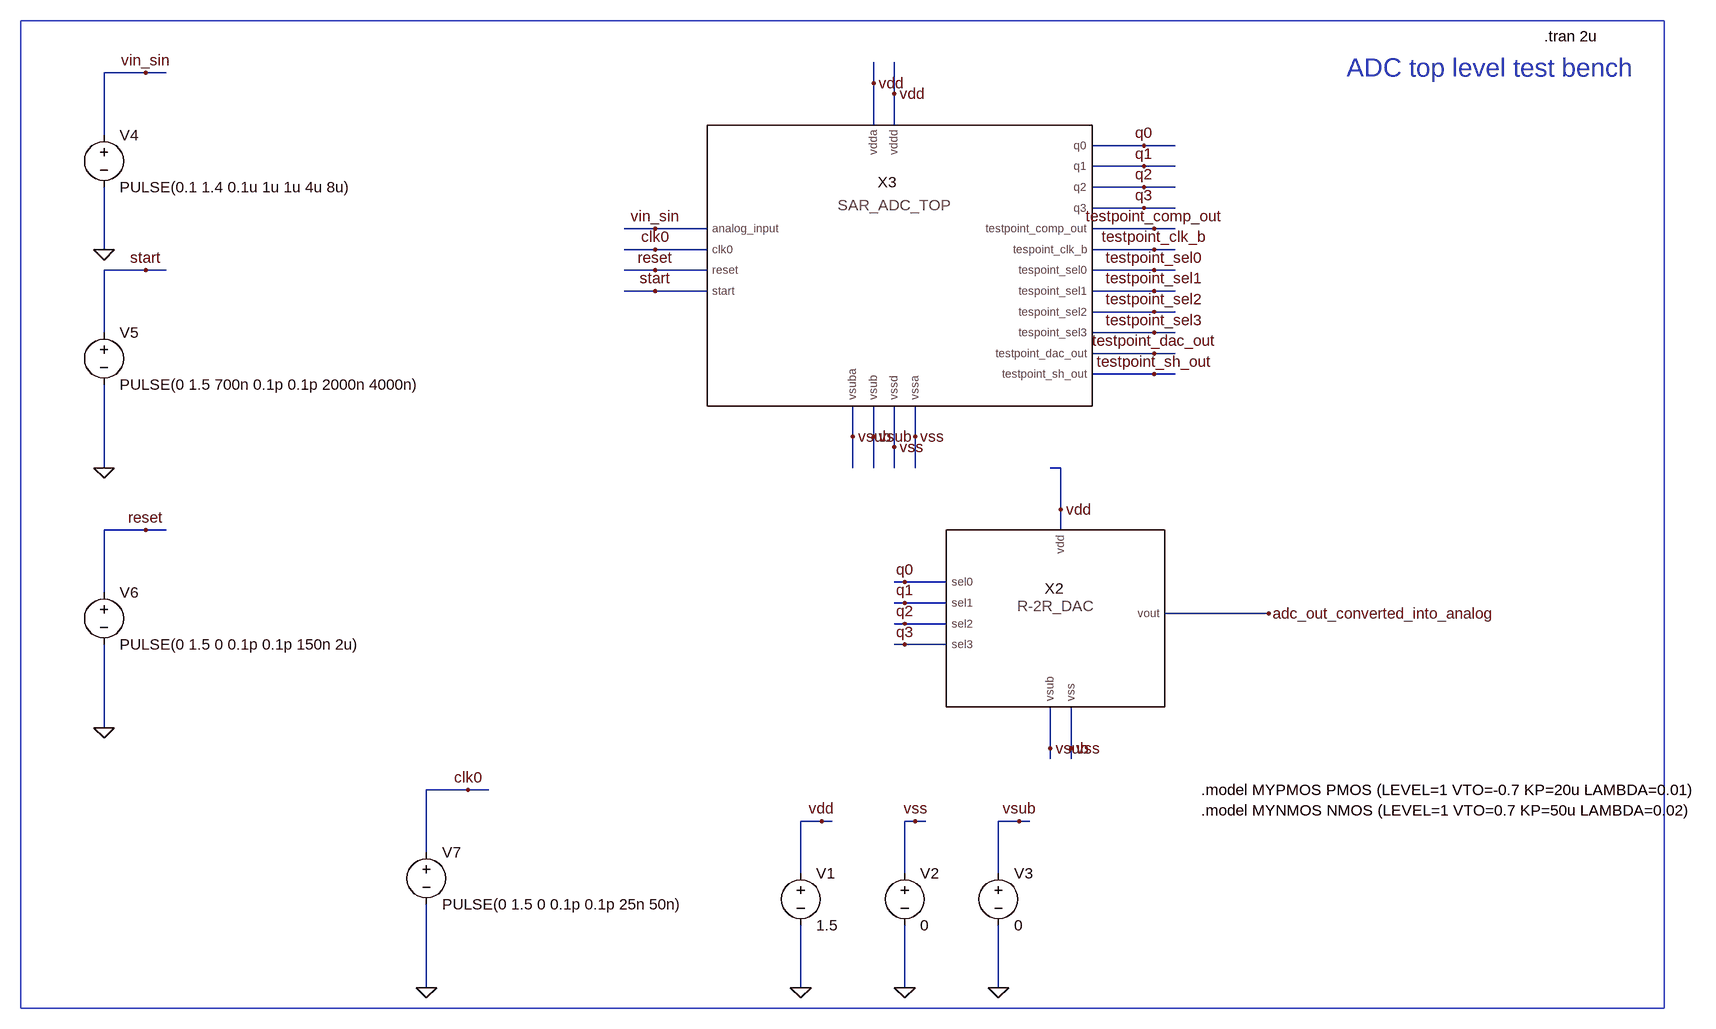
[diagram p0: schematic dsproj_adctop_tb.asc]
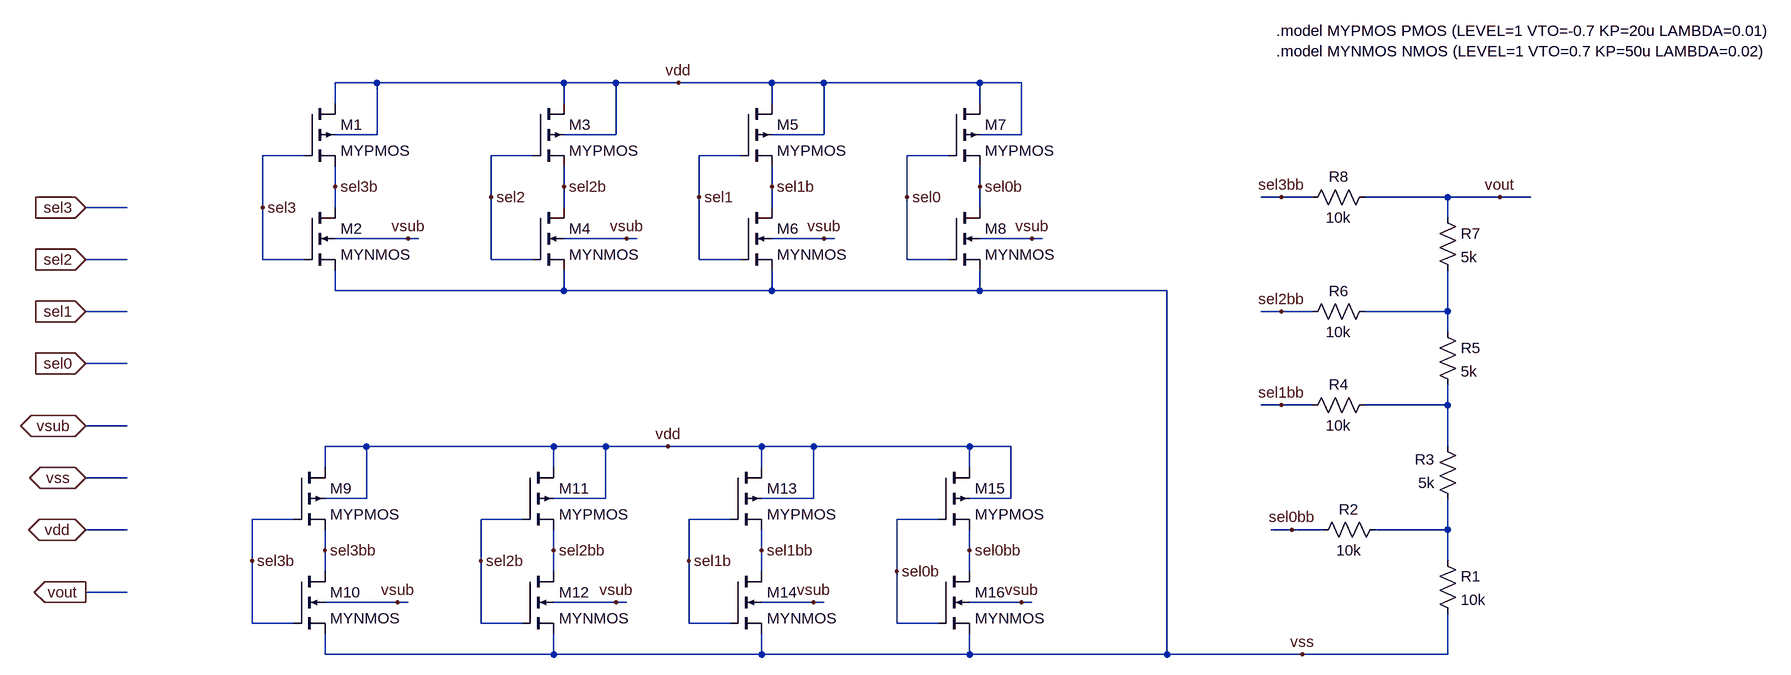
[diagram p1: sub-circuit dsproj_r2rdac.asc]
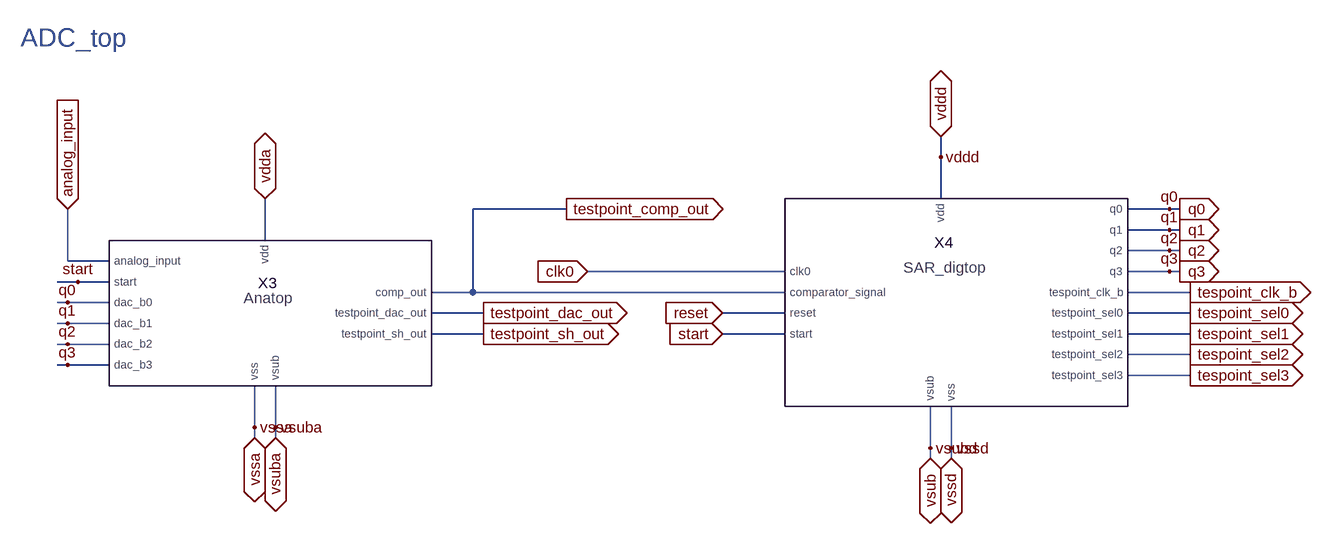
[diagram p2: sub-circuit dsproj_adctop.asc]
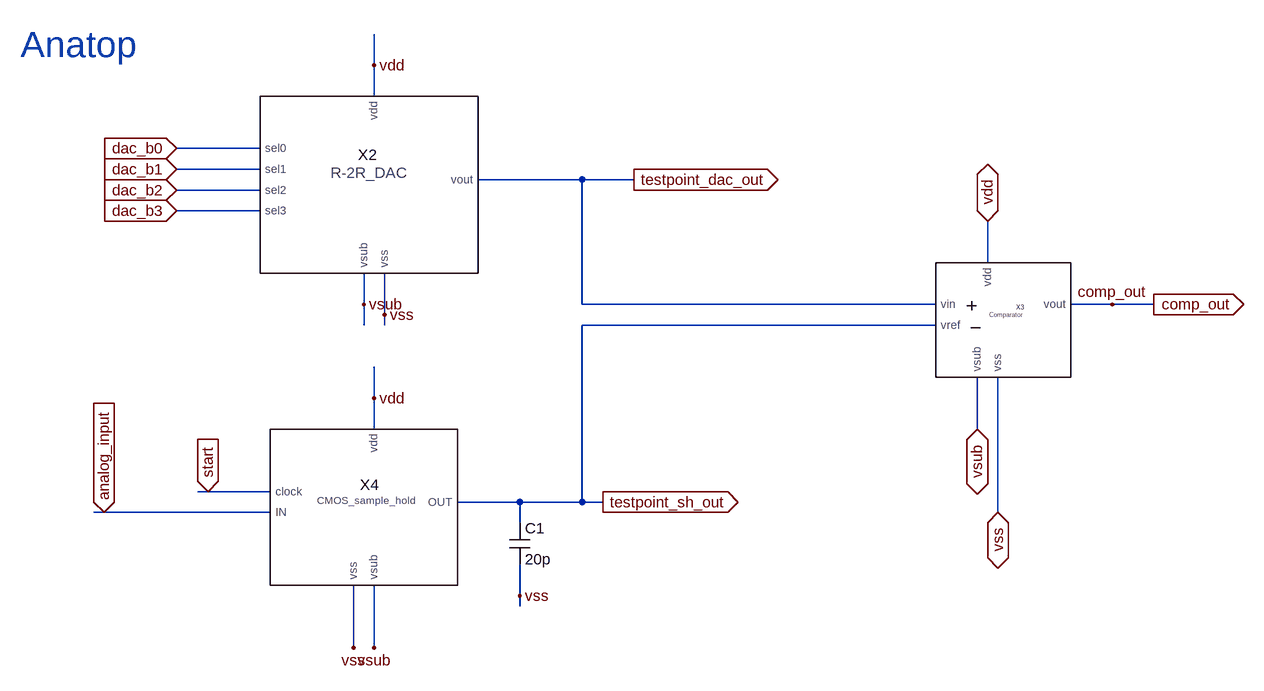
[diagram p3: sub-circuit dsproj_anatop.asc]
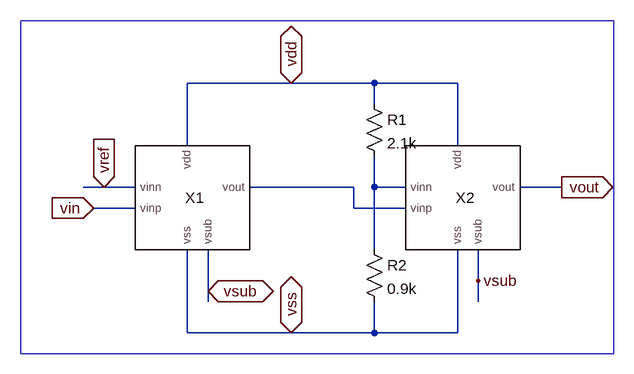
[diagram p4: sub-circuit dsproj_twostagecomparator.asc]
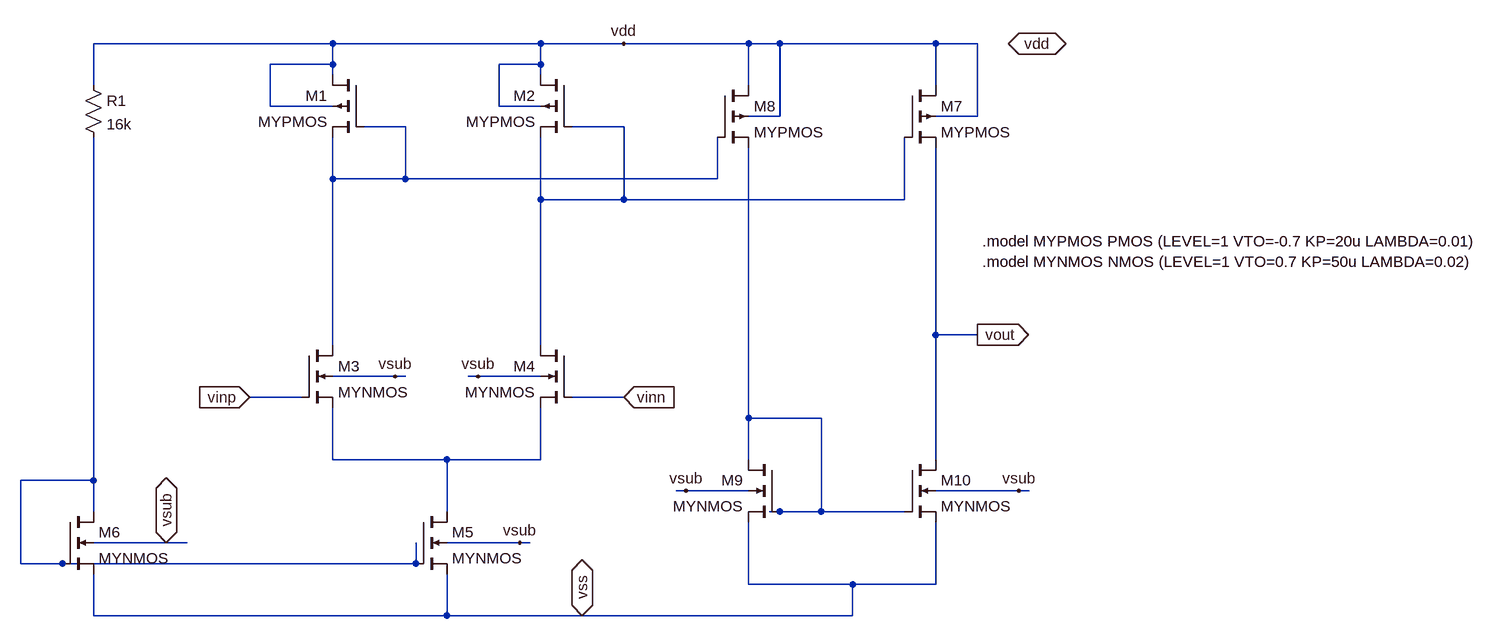
[diagram p5: sub-circuit dsproj_nmos_comparator.asc]
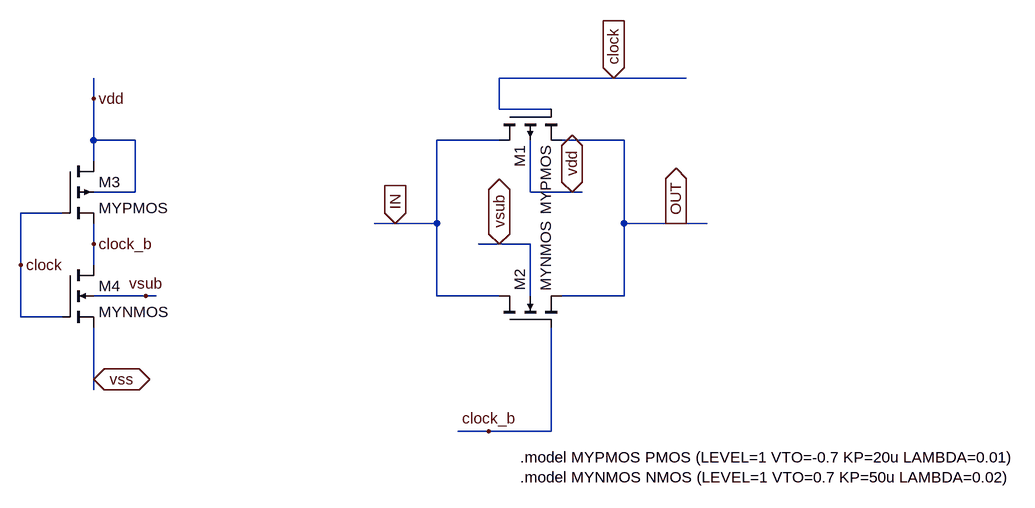
[diagram p6: sub-circuit dsproj_cmossampleandhold.asc]
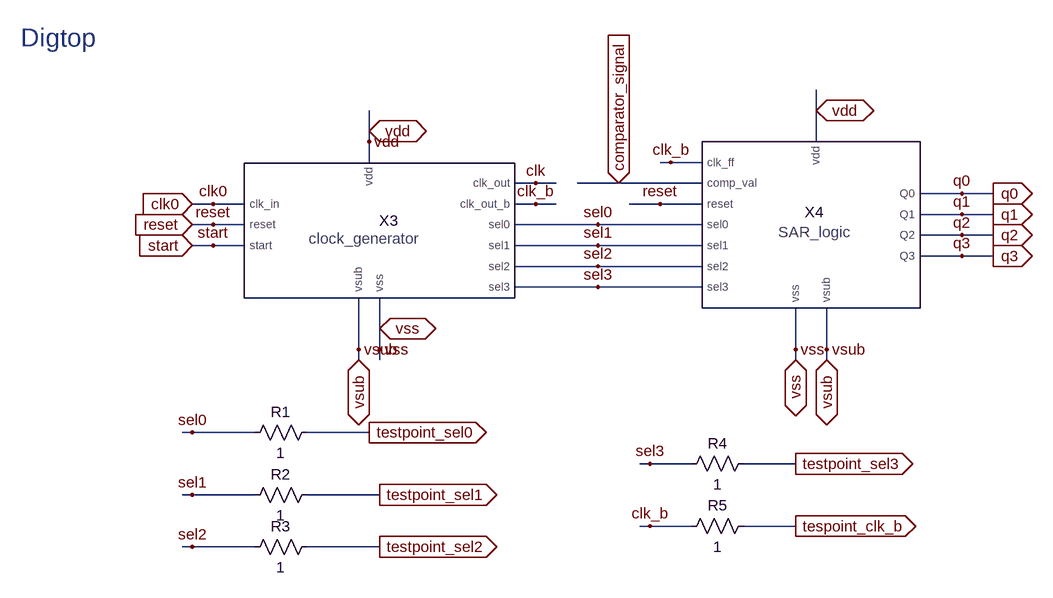
[diagram p7: sub-circuit dsproj_digtop.asc]
dsproj_adctop_tb.asc, the LTspice schematic file:
Version 4.1
SHEET 1 3284 1940
WIRE -1664 112 -1728 112
WIRE -1632 112 -1664 112
WIRE -544 128 -544 96
WIRE -512 144 -512 96
WIRE -544 192 -544 128
WIRE -512 192 -512 144
WIRE -1728 208 -1728 112
WIRE -128 224 -208 224
WIRE -80 224 -128 224
WIRE -128 256 -208 256
WIRE -80 256 -128 256
WIRE -128 288 -208 288
WIRE -80 288 -128 288
WIRE -128 320 -208 320
WIRE -80 320 -128 320
WIRE -880 352 -928 352
WIRE -800 352 -880 352
WIRE -112 352 -208 352
WIRE -80 352 -112 352
WIRE -1728 384 -1728 288
WIRE -880 384 -928 384
WIRE -800 384 -880 384
WIRE -112 384 -208 384
WIRE -80 384 -112 384
WIRE -1664 416 -1728 416
WIRE -1632 416 -1664 416
WIRE -880 416 -928 416
WIRE -800 416 -880 416
WIRE -112 416 -208 416
WIRE -80 416 -112 416
WIRE -880 448 -928 448
WIRE -800 448 -880 448
WIRE -112 448 -208 448
WIRE -80 448 -112 448
WIRE -112 480 -208 480
WIRE -80 480 -112 480
WIRE -1728 512 -1728 416
WIRE -112 512 -208 512
WIRE -80 512 -112 512
WIRE -112 544 -208 544
WIRE -80 544 -112 544
WIRE -112 576 -208 576
WIRE -80 576 -112 576
WIRE -576 672 -576 624
WIRE -544 672 -544 624
WIRE -480 672 -480 624
WIRE -512 688 -512 624
WIRE -1728 720 -1728 592
WIRE -576 720 -576 672
WIRE -544 720 -544 672
WIRE -512 720 -512 688
WIRE -480 720 -480 672
WIRE -256 720 -272 720
WIRE -256 784 -256 720
WIRE -1664 816 -1728 816
WIRE -1632 816 -1664 816
WIRE -256 816 -256 784
WIRE -496 896 -512 896
WIRE -432 896 -496 896
WIRE -1728 912 -1728 816
WIRE -496 928 -512 928
WIRE -432 928 -496 928
WIRE 64 944 -96 944
WIRE -496 960 -512 960
WIRE -432 960 -496 960
WIRE -496 992 -512 992
WIRE -432 992 -496 992
WIRE -1728 1120 -1728 992
WIRE -272 1152 -272 1088
WIRE -240 1152 -240 1088
WIRE -272 1168 -272 1152
WIRE -240 1168 -240 1152
WIRE -1168 1216 -1232 1216
WIRE -1136 1216 -1168 1216
WIRE -624 1264 -656 1264
WIRE -608 1264 -624 1264
WIRE -480 1264 -496 1264
WIRE -464 1264 -480 1264
WIRE -320 1264 -352 1264
WIRE -304 1264 -320 1264
WIRE -1232 1312 -1232 1216
WIRE -656 1344 -656 1264
WIRE -496 1344 -496 1264
WIRE -352 1344 -352 1264
WIRE -1232 1520 -1232 1392
WIRE -656 1520 -656 1424
WIRE -496 1520 -496 1424
WIRE -352 1520 -352 1424
FLAG -656 1520 0
FLAG -496 1520 0
FLAG -352 1520 0
FLAG -624 1264 vdd
FLAG -480 1264 vss
FLAG -320 1264 vsub
FLAG -544 128 vdd
FLAG -512 144 vdd
FLAG -576 672 vsub
FLAG -544 672 vsub
FLAG -512 688 vss
FLAG -480 672 vss
FLAG -128 224 q0
FLAG -128 256 q1
FLAG -128 288 q2
FLAG -128 320 q3
FLAG -112 384 testpoint_clk_b
FLAG -112 416 testpoint_sel0
FLAG -112 448 testpoint_sel1
FLAG -112 480 testpoint_sel2
FLAG -112 512 testpoint_sel3
FLAG -112 544 testpoint_dac_out
FLAG -112 576 testpoint_sh_out
FLAG -112 352 testpoint_comp_out
FLAG -880 352 vin_sin
FLAG -880 384 clk0
FLAG -880 416 reset
FLAG -880 448 start
FLAG -1728 384 0
FLAG -1728 720 0
FLAG -1664 416 start
FLAG -1728 1120 0
FLAG -1664 816 reset
FLAG -1232 1520 0
FLAG -1168 1216 clk0
FLAG -496 896 q0
FLAG -496 928 q1
FLAG -496 960 q2
FLAG -496 992 q3
FLAG -256 784 vdd
FLAG -272 1152 vsub
FLAG -240 1152 vss
FLAG 64 944 adc_out_converted_into_analog
FLAG -1664 112 vin_sin
SYMBOL voltage -656 1328 R0
WINDOW 123 0 0 Left 0
WINDOW 39 0 0 Left 0
SYMATTR InstName V1
SYMATTR Value 1.5
SYMBOL voltage -496 1328 R0
WINDOW 123 0 0 Left 0
WINDOW 39 0 0 Left 0
SYMATTR InstName V2
SYMATTR Value 0
SYMBOL voltage -352 1328 R0
WINDOW 123 0 0 Left 0
WINDOW 39 0 0 Left 0
SYMATTR InstName V3
SYMATTR Value 0
SYMBOL voltage -1728 496 R0
WINDOW 123 0 0 Left 0
WINDOW 39 0 0 Left 0
SYMATTR InstName V5
SYMATTR Value PULSE(0 1.5 700n 0.1p 0.1p 2000n 4000n)
SYMBOL voltage -1728 896 R0
WINDOW 123 0 0 Left 0
WINDOW 39 0 0 Left 0
SYMATTR InstName V6
SYMATTR Value PULSE(0 1.5 0 0.1p 0.1p 150n 2u)
SYMBOL voltage -1232 1296 R0
WINDOW 123 0 0 Left 0
WINDOW 39 24 124 Left 2
SYMATTR InstName V7
SYMATTR Value PULSE(0 1.5 0 0.1p 0.1p 25n 50n)
SYMBOL dsproj_r2rdac -336 1024 R0
SYMATTR InstName X2
SYMBOL voltage -1728 192 R0
WINDOW 123 0 0 Left 0
WINDOW 39 0 0 Left 0
SYMATTR InstName V4
SYMATTR Value PULSE(0.1 1.4 0.1u 1u 1u 4u 8u)
SYMBOL dsproj_adctop -560 416 R0
SYMATTR InstName X3
TEXT 488 56 Left 2 !.tran 2u
TEXT 184 104 Left 4 ;ADC top level test bench
TEXT -40 1216 Left 2 !.model MYPMOS PMOS (LEVEL=1 VTO=-0.7 KP=20u LAMBDA=0.01)\n.model MYNMOS NMOS (LEVEL=1 VTO=0.7 KP=50u LAMBDA=0.02)
RECTANGLE Normal 672 1552 -1856 32

The netlist it stands for:
* dsproj_adctop_tb.asc
V1 vdd 0 1.5
V2 vss 0 0
V3 vsub 0 0
V5 start 0 PULSE(0 1.5 700n 0.1p 0.1p 2000n 4000n)
V6 reset 0 PULSE(0 1.5 0 0.1p 0.1p 150n 2u)
V7 clk0 0 PULSE(0 1.5 0 0.1p 0.1p 25n 50n)
X§X2 q0 q1 q2 q3 vdd adc_out_converted_into_analog vss vsub dsproj_r2rdac
V4 vin_sin 0 PULSE(0.1 1.4 0.1u 1u 1u 4u 8u)
X§X3 vin_sin clk0 reset start testpoint_clk_b testpoint_sel0 testpoint_sel1 testpoint_sel2 testpoint_sel3 testpoint_dac_out testpoint_sh_out vdd vdd vss vss vsub vsub q0 q1 q2 q3 testpoint_comp_out dsproj_adctop

* block symbol definitions
.subckt dsproj_r2rdac sel0 sel1 sel2 sel3 vdd vout vss vsub
M1 vdd sel3 sel3b vdd MYPMOS l=180e-9 w=2.4e-6
M2 sel3b sel3 vss vsub MYNMOS l=180e-9 w=1.2e-6
M3 vdd sel2 sel2b vdd MYPMOS l=180e-9 w=2.4e-6 m=1
M4 sel2b sel2 vss vsub MYNMOS l=180e-9 w=1.2e-6 m=1
M5 vdd sel1 sel1b vdd MYPMOS l=180e-9 w=2.4e-6 m=1
M6 sel1b sel1 vss vsub MYNMOS l=180e-9 w=1.2e-6 m=1
M7 vdd sel0 sel0b vdd MYPMOS l=180e-9 w=2.4e-6 m=1
M8 sel0b sel0 vss vsub MYNMOS l=180e-9 w=1.2e-6 m=1
M9 vdd sel3b sel3bb vdd MYPMOS l=180e-9 w=2.4e-6 m=1
M10 sel3bb sel3b vss vsub MYNMOS l=180e-9 w=1.2e-6 m=1
M11 vdd sel2b sel2bb vdd MYPMOS l=180e-9 w=2.4e-6 m=1
M12 sel2bb sel2b vss vsub MYNMOS l=180e-9 w=1.2e-6 m=1
M13 vdd sel1b sel1bb vdd MYPMOS l=180e-9 w=2.4e-6 m=1
M14 sel1bb sel1b vss vsub MYNMOS l=180e-9 w=1.2e-6 m=1
M15 vdd sel0b sel0bb vdd MYPMOS l=180e-9 w=2.4e-6 m=1
M16 sel0bb sel0b vss vsub MYNMOS l=180e-9 w=1.2e-6 m=1
R1 N003 vss 10k
R2 N003 sel0bb 10k
R3 N003 N002 5k
R4 sel1bb N002 10k
R5 N001 N002 5k
R6 N001 sel2bb 10k
R7 vout N001 5k
R8 vout sel3bb 10k
.model MYPMOS PMOS (LEVEL=1 VTO=-0.7 KP=20u LAMBDA=0.01)
.model MYNMOS NMOS (LEVEL=1 VTO=0.7 KP=50u LAMBDA=0.02)
.ends dsproj_r2rdac

.subckt dsproj_adctop analog_input clk0 reset start tespoint_clk_b tespoint_sel0 tespoint_sel1 tespoint_sel2 tespoint_sel3 testpoint_dac_out testpoint_sh_out vdda vddd vssa vssd vsub vsuba q0 q1 q2 q3 testpoint_comp_out
X§X3 analog_input q0 q1 q2 q3 testpoint_comp_out testpoint_dac_out testpoint_sh_out vdda vssa vsuba start dsproj_anatop
X§X4 clk0 testpoint_comp_out reset start q0 q1 q2 q3 tespoint_clk_b tespoint_sel0 tespoint_sel1 tespoint_sel2 tespoint_sel3 vddd vssd vsub dsproj_digtop
* ADC_top
.ends dsproj_adctop

.subckt dsproj_anatop analog_input dac_b0 dac_b1 dac_b2 dac_b3 comp_out testpoint_dac_out testpoint_sh_out vdd vss vsub start
X§X2 dac_b0 dac_b1 dac_b2 dac_b3 vdd testpoint_dac_out vss vsub dsproj_r2rdac
X§X3 testpoint_dac_out testpoint_sh_out vdd comp_out vss vsub dsproj_twostagecomparator
C1 testpoint_sh_out vss 20p
X§X4 analog_input start testpoint_sh_out vdd vsub vss dsproj_cmossampleandhold
* Anatop
.ends dsproj_anatop

.subckt dsproj_twostagecomparator vin vref vdd vout vss vsub
XX1 vref vin vdd N001 vss vsub dsproj_nmos_comparator
XX2 N002 N001 vdd vout vss vsub dsproj_nmos_comparator
R1 vdd N002 2.1k
R2 N002 vss 0.9k
.ends dsproj_twostagecomparator

.subckt dsproj_nmos_comparator vinn vinp vdd vout vss vsub
M1 vdd N001 N001 vdd MYPMOS l=180e-9 w=1.2e-6 m=2
M2 vdd N002 N002 vdd MYPMOS l=180e-9 w=1.2e-6 m=2
M4 N002 vinn N004 vsub MYNMOS l=180e-9 w=1.2e-6 m=3
M5 N004 N005 vss vsub MYNMOS l=3e-6 w=10e-6 m=2
R1 vdd N005 16k
M6 N005 N005 vss vsub MYNMOS l=3e-6 w=10e-6 m=2
M3 N001 vinp N004 vsub MYNMOS l=180e-9 w=1.2e-6 m=3
M7 vdd N002 vout vdd MYPMOS l=180e-9 w=1.2e-6 m=2
M8 vdd N001 N003 vdd MYPMOS l=180e-9 w=1.2e-6 m=2
M9 N003 N003 vss vsub MYNMOS l=180e-9 w=1.2e-6 m=1
M10 vout N003 vss vsub MYNMOS l=180e-9 w=1.2e-6 m=1
.model MYPMOS PMOS (LEVEL=1 VTO=-0.7 KP=20u LAMBDA=0.01)
.model MYNMOS NMOS (LEVEL=1 VTO=0.7 KP=50u LAMBDA=0.02)
.ends dsproj_nmos_comparator

.subckt dsproj_cmossampleandhold IN clock OUT vdd vsub vss
M1 IN clock OUT vdd MYPMOS l=180e-9 w=2400e-9
M2 IN clock_b OUT vsub MYNMOS l=180e-9 w=1200e-9
M3 vdd clock clock_b vdd MYPMOS l=180e-9 w=2.4e-6 m=1
M4 clock_b clock vss vsub MYNMOS l=180e-9 w=1.2e-6 m=1
.model MYPMOS PMOS (LEVEL=1 VTO=-0.7 KP=20u LAMBDA=0.01)
.model MYNMOS NMOS (LEVEL=1 VTO=0.7 KP=50u LAMBDA=0.02)
.ends dsproj_cmossampleandhold

.subckt dsproj_digtop clk0 comparator_signal reset start q0 q1 q2 q3 tespoint_clk_b testpoint_sel0 testpoint_sel1 testpoint_sel2 testpoint_sel3 vdd vss vsub
R1 testpoint_sel0 sel0 1
R2 testpoint_sel1 sel1 1
R3 testpoint_sel2 sel2 1
R4 testpoint_sel3 sel3 1
R5 tespoint_clk_b clk_b 1
X§X3 clk0 reset start clk clk_b sel0 sel1 sel2 sel3 vdd vss vsub dsproj_clkgenerator
X§X4 clk_b comparator_signal reset sel0 sel1 sel2 sel3 q0 q1 q2 q3 vsub vss vdd dsproj_sarlogicblock
* Digtop
.ends dsproj_digtop

.subckt dsproj_clkgenerator clk_in reset start clk_out clk_out_b sel0 sel1 sel2 sel3 vdd vss vsub
X§X1 start clr_ff1 start_d vss start_ff NC_01 vdd vss vsub dsproj_dff
X§X2 clk_ff reset start_ff vss sel3 NC_02 vdd vss vsub dsproj_dff
X§X3 clk_ff reset sel3 vss sel2 NC_03 vdd vss vsub dsproj_dff
X§X4 clk_ff reset sel2 vss sel1 NC_04 vdd vss vsub dsproj_dff
X§X5 clk_ff reset sel1 vss sel0 NC_05 vdd vss vsub dsproj_dff
X§X6 clk_in reset N002 vss clk_ff NC_06 vdd vss vsub dsproj_dff
R1 sel0 0 100e3
A1 start_ff 0 0 0 0 start_d 0 0 BUF
A2 clk_ff 0 0 0 0 N002 0 0 BUF
A3 0 sel3 reset 0 0 0 clr_ff1 0 OR
A4 clk_in 0 0 0 0 clk_out_b 0 0 BUF
A5 clk_out_b 0 0 0 0 clk_out 0 0 BUF
.model MYPMOS PMOS (LEVEL=1 VTO=-0.7 KP=20u LAMBDA=0.01)
.model MYNMOS NMOS (LEVEL=1 VTO=0.7 KP=50u LAMBDA=0.02)
.ends dsproj_clkgenerator

.subckt dsproj_dff CLK CLR D PRE Q Qb vdd vss vsub
A1 N004 0 N005 PRE N010 N006 N001 0 DFLOP
M1 vdd N003 N004 vdd MYPMOS l=180e-9 w=2400e-9
M2 N004 N003 vss vsub MYNMOS l=180e-9 w=1200e-9
M3 vdd D N003 vdd MYPMOS l=180e-9 w=2400e-9
M4 N003 D vss vsub MYNMOS l=180e-9 w=1200e-9
M5 vdd N007 N005 vdd MYPMOS l=180e-9 w=2400e-9
M6 N005 N007 vss vsub MYNMOS l=180e-9 w=1200e-9
M7 vdd CLK N007 vdd MYPMOS l=180e-9 w=2400e-9
M8 N007 CLK vss vsub MYNMOS l=180e-9 w=1200e-9
M9 vdd N002 Q vdd MYPMOS l=180e-9 w=2400e-9
M10 Q N002 vss vsub MYNMOS l=180e-9 w=1200e-9
M11 vdd N001 N002 vdd MYPMOS l=180e-9 w=2400e-9
M12 N002 N001 vss vsub MYNMOS l=180e-9 w=1200e-9
M13 vdd N008 Qb vdd MYPMOS l=180e-9 w=2400e-9
M14 Qb N008 vss vsub MYNMOS l=180e-9 w=1200e-9
M15 vdd N006 N008 vdd MYPMOS l=180e-9 w=2400e-9
M16 N008 N006 vss vsub MYNMOS l=180e-9 w=1200e-9
M17 vdd N009 N010 vdd MYPMOS l=180e-9 w=2400e-9
M18 N010 N009 vss vsub MYNMOS l=180e-9 w=1200e-9
M19 vdd CLR N009 vdd MYPMOS l=180e-9 w=2400e-9
M20 N009 CLR vss vsub MYNMOS l=180e-9 w=1200e-9
.tran 200
.model MYPMOS PMOS (LEVEL=1 VTO=-0.7 KP=20u LAMBDA=0.01)
.model MYNMOS NMOS (LEVEL=1 VTO=0.7 KP=50u LAMBDA=0.02)
.ends dsproj_dff

.subckt dsproj_sarlogicblock clk_ff comp_val reset sel0 sel1 sel2 sel3 Q0 Q1 Q2 Q3 vsub vss vdd
X§X1 comp_val N001 sel0 vsub N002 vdd vss dsproj_2to1mux
X§X2 clk_ff_0 reset N002 vss Q0 NC_01 vdd vss vsub dsproj_dff
A1 Q0 0 0 0 0 N001 0 0 BUF
X§X3 comp_val N003 sel1 vsub N004 vdd vss dsproj_2to1mux
X§X4 clk_ff_1 reset N004 vss Q1 NC_02 vdd vss vsub dsproj_dff
A2 Q1 0 0 0 0 N003 0 0 BUF
X§X5 comp_val N005 sel2 vsub N006 vdd vss dsproj_2to1mux
X§X6 clk_ff_2 reset N006 vss Q2 NC_03 vdd vss vsub dsproj_dff
A3 Q2 0 0 0 0 N005 0 0 BUF
X§X7 comp_val N007 sel3 vsub N008 vdd vss dsproj_2to1mux
X§X8 clk_ff_3 reset N008 vss Q3 NC_04 vdd vss vsub dsproj_dff
A4 Q3 0 0 0 0 N007 0 0 BUF
A5 0 sel0 clk_ff vdd 0 0 clk_ff_0 0 AND
A6 0 sel1 clk_ff vdd 0 0 clk_ff_1 0 AND
A7 0 sel2 clk_ff vdd 0 0 clk_ff_2 0 AND
A8 0 sel3 clk_ff vdd 0 0 clk_ff_3 0 AND
.model MYPMOS PMOS (LEVEL=1 VTO=-0.7 KP=20u LAMBDA=0.01)
.model MYNMOS NMOS (LEVEL=1 VTO=0.7 KP=50u LAMBDA=0.02)
.ends dsproj_sarlogicblock

.subckt dsproj_2to1mux A B sela vsub out vdd vss
M1 vdd sela_b sela_bb vdd MYPMOS l=180e-9 w=2400e-9
M2 sela_bb sela_b vss vsub MYNMOS l=180e-9 w=1200e-9
M3 vdd sela sela_b vdd MYPMOS l=180e-9 w=2400e-9
M4 sela_b sela vss vsub MYNMOS l=180e-9 w=1200e-9
M5 N002 B out vdd MYPMOS l=180e-9 w=2400e-9
M6 out B N003 vsub MYNMOS l=180e-9 w=1200e-9
M7 N001 A out vdd MYPMOS l=180e-9 w=2400e-9
M8 out A N004 vsub MYNMOS l=180e-9 w=1200e-9
M9 vdd sela_b N001 vdd MYPMOS l=180e-9 w=2400e-9
M10 N004 sela_bb vss vsub MYNMOS l=180e-9 w=1200e-9
M11 vdd sela_bb N002 vdd MYPMOS l=180e-9 w=2400e-9
M12 N003 sela_b vss vsub MYNMOS l=180e-9 w=1200e-9
* 2-to-1-Mux
.model MYPMOS PMOS (LEVEL=1 VTO=-0.7 KP=20u LAMBDA=0.01)
.model MYNMOS NMOS (LEVEL=1 VTO=0.7 KP=50u LAMBDA=0.02)
.ends dsproj_2to1mux

.model NMOS NMOS
.model PMOS PMOS
.lib standard.mos
.tran 2u
* ADC top level test bench
.model MYPMOS PMOS (LEVEL=1 VTO=-0.7 KP=20u LAMBDA=0.01)
.model MYNMOS NMOS (LEVEL=1 VTO=0.7 KP=50u LAMBDA=0.02)
.backanno
.end